# EAGLE design test_brd_add_gnd (EAGLE 9.5.2)
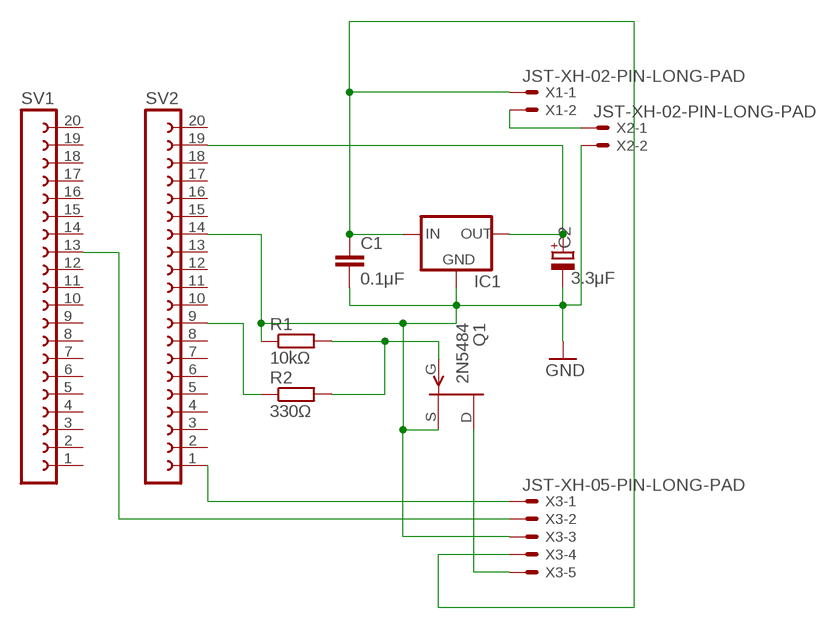
[diagram p0: schematic, sheet 1]

## Parts
C1  0.1μF  C-EU025-040X050  [C025-040X050]
C2  3.3μF  CPOL-EUE2.5-5  [E2,5-5]
IC1  78XXS  [78XXS]
Q1  2N5484  [TO92-]
R1  10kΩ  R-EU_0207/10  [0207/10]
R2  330Ω  R-EU_0207/10  [0207/10]
SV1  FE20-1  [FE20]
SV2  FE20-1  [FE20]
X1  JST-XH-02-PIN-LONG-PAD  [JST-XH-02-PACKAGE-LONG-PAD]
X2  JST-XH-02-PIN-LONG-PAD  [JST-XH-02-PACKAGE-LONG-PAD]
X3  JST-XH-05-PIN-LONG-PAD  [JST-XH-05-PACKAGE-LONG-PAD]

## Nets
GND: C1.2 C2.- IC1.GND Q1.2(S) R1.1 SV2.14 X2.2 X3.3
N$1: C1.1 IC1.IN X1.1 X3.4
N$2: C2.+ IC1.OUT SV2.19
N$4: Q1.1(G) R1.2 R2.2
N$5: R2.1 SV2.9
N$6: X1.2 X2.1
N$7: SV2.1 X3.1
N$8: SV1.13 X3.2
N$9: Q1.3(D) X3.5
Unconnected: SV1.1 SV1.2 SV1.3 SV1.4 SV1.5 SV1.6 SV1.7 SV1.8 SV1.9 SV1.10 SV1.11 SV1.12 SV1.14 SV1.15 SV1.16 SV1.17 SV1.18 SV1.19 SV1.20 SV2.2 SV2.3 SV2.4 SV2.5 SV2.6 SV2.7 SV2.8 SV2.10 SV2.11 SV2.12 SV2.13 SV2.15 SV2.16 SV2.17 SV2.18 SV2.20

## Library data of the parts
C1 = resistor:C-EU: CAPACITOR, European symbol
C2 = resistor:CPOL-EU: POLARIZED CAPACITOR, European symbol
IC1 = v-reg:78XXS: VOLTAGE REGULATOR
Q1 = transistor-fet:?548*: N-Channel JFETs Source: VISHAY 2N5484.pdf Compatible: TO92 2N5245 J304 J305 U310 J308 J309 J310 TO72 2N4416 2N4416A 2N3823 2N4351 3N169 3N170 3N171 MFE3002 TO18 2N3796 2N3797 MFE825 Source: Motorola European Master Guide Pacge 3-59
R1 R2 = resistor:R-EU_: RESISTOR, European symbol
SV1 SV2 = con-lsta:FE20-1: FEMALE HEADER; OC_FARNELL: unknown; OC_NEWARK: unknown
X1 X2 = Rembrandt Electronics - JST XH Connectors v1-0:JST-XH-02-PIN: JST XH Connector 2 Pin Wire to board connector. Pitch: 2,54 mm, (0.100") Number of pins: 2 Created by Rembrandt Electronics www.rembrandtelectronics.com
X3 = Rembrandt Electronics - JST XH Connectors v1-0:JST-XH-05-PIN: JST XH Connector 2 Pin Wire to board connector. Pitch: 2,54 mm, (0.100") Number of pins: 5 Created by Rembrandt Electronics www.rembrandtelectronics.com

## Net classes
0 default: width 0.254 mm

## Board
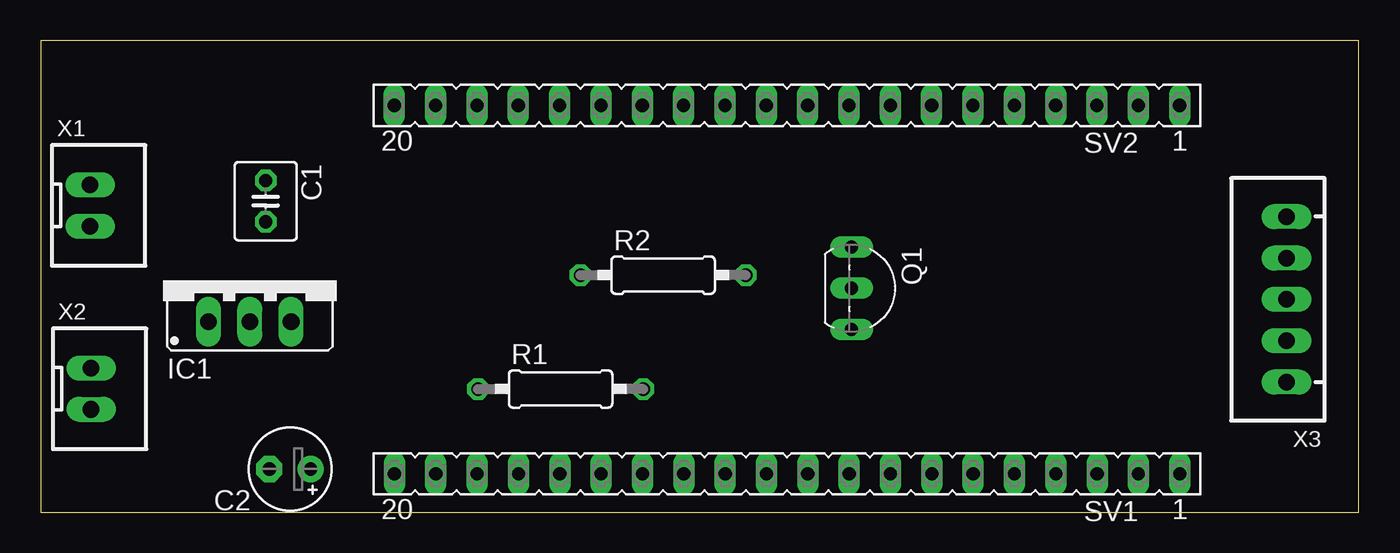
[diagram p1: board, top side]
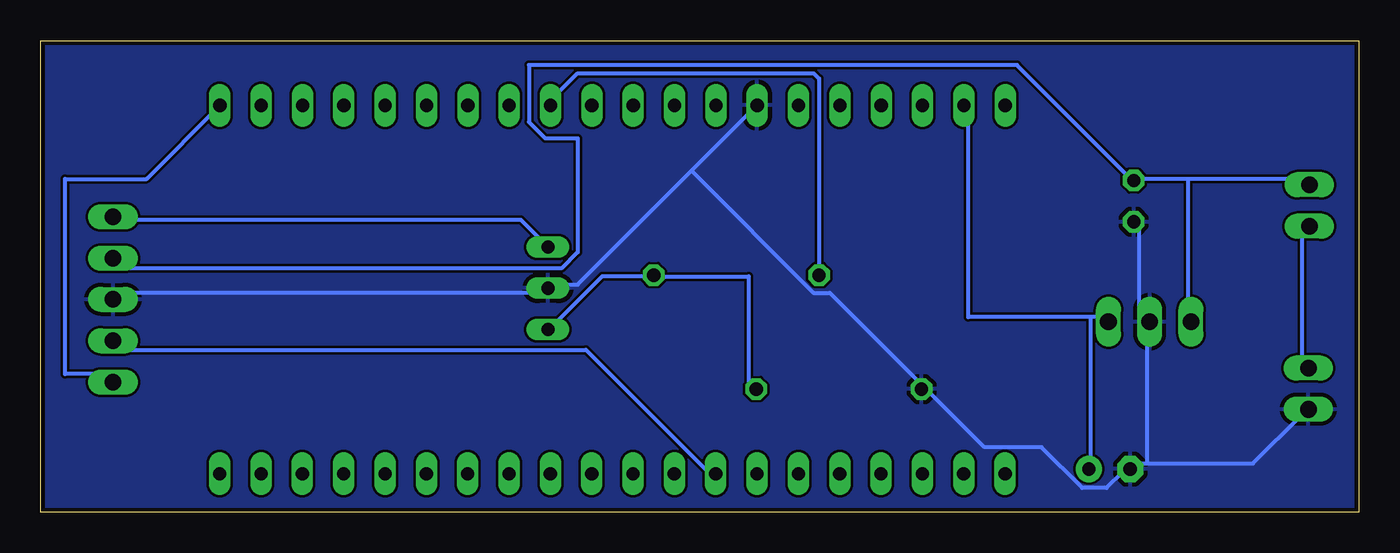
[diagram p2: board, bottom side, seen from below]

Size 81 x 29 mm. Coordinates in mm from the lower left corner, seen from the top.
Outline: 0,0 81,0 81,29 0,29 0,0
Copper layers (1*16): Top 0.035mm / dielectric 1.5mm / Bottom 0.035mm
Design rules "SeeedStudio_2layer_DRU_no_angle_20140221": minimum track width 6mil, minimum drill 12mil, track to track 6mil, track to pad 6mil, pad to pad 6mil, via to via 6mil, smd to smd 0mil, copper to edge 10mil, drill to drill 10mil, minimum pad ring 10mil, minimum via ring 6mil, stop-mask expansion 2mil, vias tented up to drill 100mil, thermal gap 10mil

### Footprints (pad centres in the part's own frame; a part is rotated, then mirrored left to right if it is on the bottom)
C025-040X050 = drill 0.813 octagon: 1 -1.27,0; 2 1.27,0
E2,5-5 = drill 0.813 pad 1.6: + -1.27,0 | drill 0.813 pad 1.6 octagon: - 1.27,0
78XXS = drill 1.016 long: GND 0,-2.54; IN -2.54,-2.54; OUT 2.54,-2.54
TO92- = drill 0.813 long: 1 2.54,0; 2 0,0; 3 -2.54,0
0207/10 = drill 0.813 octagon: 1 -5.08,0; 2 5.08,0
FE20 = drill 0.813 long: 1 -24.13,0; 2 -21.59,0; 3 -19.05,0; 4 -16.51,0; 5 -13.97,0; 6 -11.43,0; 7 -8.89,0; 8 -6.35,0; 9 -3.81,0; 10 -1.27,0; 11 1.27,0; 12 3.81,0; 13 6.35,0; 14 8.89,0; 15 11.43,0; 16 13.97,0; 17 16.51,0; 18 19.05,0; 19 21.59,0; 20 24.13,0
JST-XH-02-PACKAGE-LONG-PAD = drill 1.016 long: 1 -1.27,0; 2 1.27,0
JST-XH-05-PACKAGE-LONG-PAD = drill 1.016 long: 1 -5.08,0; 2 -2.54,0; 3 0,0; 4 2.54,0; 5 5.08,0

### Placement (x,y rotation side)
C1  13.83,19.13 270 top
C2  15.32,2.66 180 top
IC1  12.85,14.26 0 top
Q1  49.83,13.78 270 top
R1  31.95,7.58 0 top
R2  38.25,14.58 0 top
SV1  45.87,2.37 180 top
SV2  45.86,25.02 180 top
X1  3.04,18.87 270 top
X2  3.1,7.6 270 top
X3  76.55,13.09 90 top

### Tracks (layer width: path | path; a pad name or v marks a point on that pad's centre or on a via)
GND
  Bottom 0.254: C1.2 13.5,17.5 13.5,12 13,12 IC1.GND 13,11.5 13,3 | 13,3 14,3 C2.- 14.5,2.5 15.5,1.5 17,1.5 19.5,4 23,4 26.5,7.5 R1.1 27,8 32.5,13.5 33.5,13.5 41,21 | 13,3 6.5,3 3.5,6 X2.2 | 41,21 48,14 49.5,14 Q1.2 50,13.5 76.5,13.5 X3.3 | 41,21 37,25 SV2.14
  pour Bottom: 0,29 0,0 81,0 81,29
  pour Bottom: 0,29 81,29 82,28 82,1 81,0 0,0
N$1
  Bottom 0.254: 10.5,20.5 3.5,20.5 X1.1 | 10.5,20.5 13.5,20.5 C1.1 14,20.5 21,27.5 51,27.5 51,24 50,23 48,23 48,16 49,15 76,15 76.5,15.5 X3.4 | 10.5,20.5 10.5,12 IC1.IN
N$2
  Bottom 0.254: 16.5,12 15.5,12 IC1.OUT | 16.5,12 24,12 24,25 SV2.19 | 16.5,12 16.5,3 C2.+
N$4
  Bottom 0.254: R1.2 37.5,8 37.5,14.5 43,14.5 R2.2 43.5,14.5 46.5,14.5 49.5,11.5 Q1.1
N$5
  Bottom 0.254: SV2.9 49.5,25.5 48,27 33.5,27 33.17,26.67 R2.1
N$6
  Bottom 0.254: X2.1 3.5,9 3.5,17.5 X1.2
N$7
  Bottom 0.254: SV2.1 70,25 74.5,20.5 79.5,20.5 79.5,8.5 77,8.5 X3.1
N$8
  Bottom 0.254: X3.2 76,10 47.5,10 40,2.5 SV1.13
N$9
  Bottom 0.254: Q1.3 50,16.5 51.5,18 76.5,18 X3.5